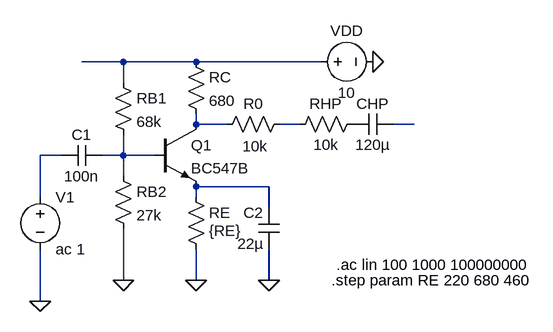
[diagram p0: schematic common_emitter_amplifier.asc]
common_emitter_amplifier.asc, the LTspice schematic file:
Version 4.1
SHEET 1 880 680
WIRE 160 -96 96 -96
WIRE 272 -96 160 -96
WIRE 464 -96 272 -96
WIRE 160 -64 160 -96
WIRE 272 0 272 -16
WIRE 320 0 272 0
WIRE 432 0 400 0
WIRE 608 0 576 0
WIRE 64 48 32 48
WIRE 160 48 160 16
WIRE 160 48 128 48
WIRE 208 48 160 48
WIRE 160 80 160 48
WIRE 384 96 272 96
WIRE 32 112 32 48
WIRE 272 112 272 96
WIRE 384 128 384 96
WIRE 160 240 160 160
WIRE 272 240 272 192
WIRE 384 240 384 192
WIRE 32 272 32 192
FLAG 32 272 0
FLAG 160 240 0
FLAG 272 240 0
FLAG 384 240 0
FLAG 544 -96 0
SYMBOL voltage 32 96 R0
WINDOW 123 0 0 Left 0
WINDOW 39 0 0 Left 0
SYMATTR InstName V1
SYMATTR Value ac 1
SYMBOL res 144 64 R0
SYMATTR InstName RB2
SYMATTR Value 27k
SYMBOL res 256 96 R0
WINDOW 3 36 68 Left 2
SYMATTR InstName RE
SYMATTR Value {RE}
SYMBOL res 144 -80 R0
SYMATTR InstName RB1
SYMATTR Value 68k
SYMBOL res 256 -112 R0
SYMATTR InstName RC
SYMATTR Value 680
SYMBOL res 416 -16 R90
WINDOW 0 0 56 VBottom 2
WINDOW 3 34 53 VTop 2
SYMATTR InstName R0
SYMATTR Value 10k
SYMBOL cap 128 32 R90
WINDOW 0 0 32 VBottom 2
WINDOW 3 32 32 VTop 2
SYMATTR InstName C1
SYMATTR Value 100n
SYMBOL cap 400 192 R180
WINDOW 0 24 56 Left 2
WINDOW 3 24 8 Left 2
SYMATTR InstName C2
SYMATTR Value 22µ
SYMBOL voltage 448 -96 R270
WINDOW 0 32 56 VTop 2
WINDOW 3 -32 56 VBottom 2
SYMATTR InstName VDD
SYMATTR Value 10
SYMBOL npn 208 0 R0
SYMATTR InstName Q1
SYMATTR Value BC547B
SYMBOL cap 576 -16 R90
WINDOW 0 0 32 VBottom 2
WINDOW 3 32 32 VTop 2
SYMATTR InstName CHP
SYMATTR Value 120µ
SYMBOL res 528 -16 R90
WINDOW 0 0 56 VBottom 2
WINDOW 3 32 56 VTop 2
SYMATTR InstName RHP
SYMATTR Value 10k
TEXT 480 240 Left 2 !.step param RE 220 680 460
TEXT 488 216 Left 2 !.ac lin 100 1000 100000000

The netlist it stands for:
* common_emitter_amplifier.asc
V1 N005 0 ac 1
RB2 N006 0 27k
RE N007 0 {RE}
RB1 N001 N006 68k
RC N001 N002 680
R0 N003 N002 10k
C1 N006 N005 100n
C2 0 N007 22µ
VDD N001 0 10
Q1 N002 N006 N007 0 BC547B
CHP N004 P001 120µ
RHP P001 N003 10k
.model NPN NPN
.model PNP PNP
.lib standard.bjt
.step param RE 220 680 460
.ac lin 100 1000 100000000
.backanno
.end